# Altium project HSBNE-MAIN.PrjPcb
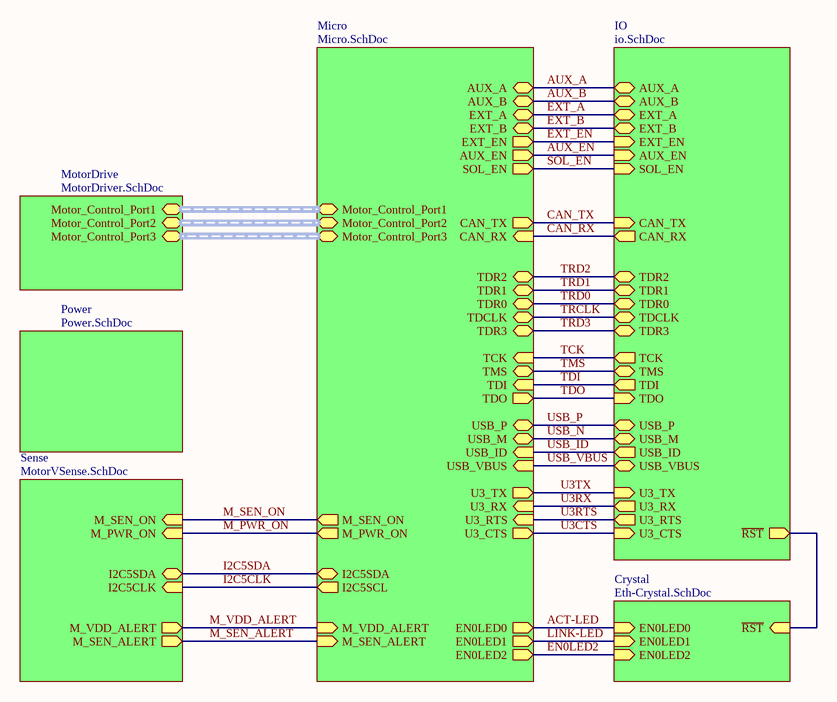
[diagram p0: Main.SchDoc]
3 sheets, 54 parts. Net scope: hierarchical (ports join the sheet entries above them; power ports are global).
Board file: HSBNE-MOTOR.PcbDoc
Sheets:
  Main.SchDoc
    MotorDrive = MotorDriver.SchDoc
    Crystal = Eth-Crystal.SchDoc

## Sheet Main.SchDoc
size A

### Sub-sheets
Crystal = Eth-Crystal.SchDoc: EN0LED0 (in), EN0LED1 (in), EN0LED2 (in), ~{RST} (in)
IO = io.SchDoc (file not in this document): CAN_TX (in), CAN_RX (out), TCK (out), TMS (bidir), TDI (out), TDO (in), U3_RTS (out), U3_CTS (in), U3_TX (in), U3_RX (out), USB_P (bidir), USB_M (bidir), USB_ID (out), ~{RST} (out), TDR1 (bidir), TDR0 (bidir), TDR2 (bidir), TDCLK (bidir), TDR3 (bidir), SOL_EN (in), USB_VBUS, AUX_EN (in), EXT_EN (in), AUX_A (bidir), AUX_B (bidir), EXT_A (bidir), EXT_B (bidir)
Micro = Micro.SchDoc (file not in this document): CAN_TX (out), CAN_RX (in), Motor_Control_Port1 (harness MCP), Motor_Control_Port2 (harness MCP), Motor_Control_Port3 (harness MCP), TCK (in), TMS (bidir), TDI (in), TDO (out), EN0LED0 (out), EN0LED1 (out), EN0LED2 (out), USB_P (bidir), USB_M (bidir), USB_ID (in), USB_VBUS (in), M_PWR_ON (out), M_SEN_ON (out), U3_TX (out), U3_RX (in), U3_RTS (in), U3_CTS (out), M_VDD_ALERT (in), M_SEN_ALERT (in), TDR3 (bidir), TDR0 (bidir), TDCLK (bidir), TDR2 (bidir), TDR1 (bidir), I2C5SDA (bidir), I2C5SCL (out), SOL_EN (out), AUX_A (bidir), AUX_B (bidir), EXT_A (bidir), EXT_B (bidir), EXT_EN (out), AUX_EN (out)
MotorDrive = MotorDriver.SchDoc: Motor_Control_Port1 (harness MCP), Motor_Control_Port2 (harness MCP), Motor_Control_Port3 (harness MCP)
Power = Power.SchDoc (file not in this document): no entries
Sense = MotorVSense.SchDoc (file not in this document): M_SEN_ON (in), M_PWR_ON (in), I2C5CLK (in), M_VDD_ALERT (out), M_SEN_ALERT (out), I2C5SDA (bidir)

### Nets
ACT-LED: sheet Micro/EN0LED0, sheet Crystal/EN0LED0
AUX_A: sheet Micro/AUX_A, sheet IO/AUX_A
AUX_B: sheet Micro/AUX_B, sheet IO/AUX_B
AUX_EN: sheet Micro/AUX_EN, sheet IO/AUX_EN
CAN_RX: sheet Micro/CAN_RX, sheet IO/CAN_RX
CAN_TX: sheet Micro/CAN_TX, sheet IO/CAN_TX
EN0LED2: sheet Micro/EN0LED2, sheet Crystal/EN0LED2
EXT_A: sheet Micro/EXT_A, sheet IO/EXT_A
EXT_B: sheet Micro/EXT_B, sheet IO/EXT_B
EXT_EN: sheet Micro/EXT_EN, sheet IO/EXT_EN
I2C5CLK: sheet Micro/I2C5SCL, sheet Sense/I2C5CLK
I2C5SDA: sheet Micro/I2C5SDA, sheet Sense/I2C5SDA
LINK-LED: sheet Micro/EN0LED1, sheet Crystal/EN0LED1
M_PWR_ON: sheet Micro/M_PWR_ON, sheet Sense/M_PWR_ON
M_SEN_ALERT: sheet Micro/M_SEN_ALERT, sheet Sense/M_SEN_ALERT
M_SEN_ON: sheet Micro/M_SEN_ON, sheet Sense/M_SEN_ON
M_VDD_ALERT: sheet Micro/M_VDD_ALERT, sheet Sense/M_VDD_ALERT
~{RST}: sheet Crystal/~{RST}, sheet IO/~{RST}
SOL_EN: sheet Micro/SOL_EN, sheet IO/SOL_EN
TCK: sheet Micro/TCK, sheet IO/TCK
TDI: sheet Micro/TDI, sheet IO/TDI
TDO: sheet Micro/TDO, sheet IO/TDO
TMS: sheet Micro/TMS, sheet IO/TMS
TRCLK: sheet Micro/TDCLK, sheet IO/TDCLK
TRD0: sheet Micro/TDR0, sheet IO/TDR0
TRD1: sheet Micro/TDR1, sheet IO/TDR1
TRD2: sheet Micro/TDR2, sheet IO/TDR2
TRD3: sheet Micro/TDR3, sheet IO/TDR3
U3CTS: sheet Micro/U3_CTS, sheet IO/U3_CTS
U3RTS: sheet Micro/U3_RTS, sheet IO/U3_RTS
U3RX: sheet Micro/U3_RX, sheet IO/U3_RX
U3TX: sheet Micro/U3_TX, sheet IO/U3_TX
USB_ID: sheet Micro/USB_ID, sheet IO/USB_ID
USB_N: sheet Micro/USB_M, sheet IO/USB_M
USB_P: sheet Micro/USB_P, sheet IO/USB_P
USB_VBUS: sheet Micro/USB_VBUS, sheet IO/USB_VBUS

### Buses and harness runs
harness sheet Micro/Motor_Control_Port1 = sheet MotorDrive/Motor_Control_Port1
harness sheet Micro/Motor_Control_Port2 = sheet MotorDrive/Motor_Control_Port2
harness sheet Micro/Motor_Control_Port3 = sheet MotorDrive/Motor_Control_Port3

## Sheet MotorDriver.SchDoc
size A
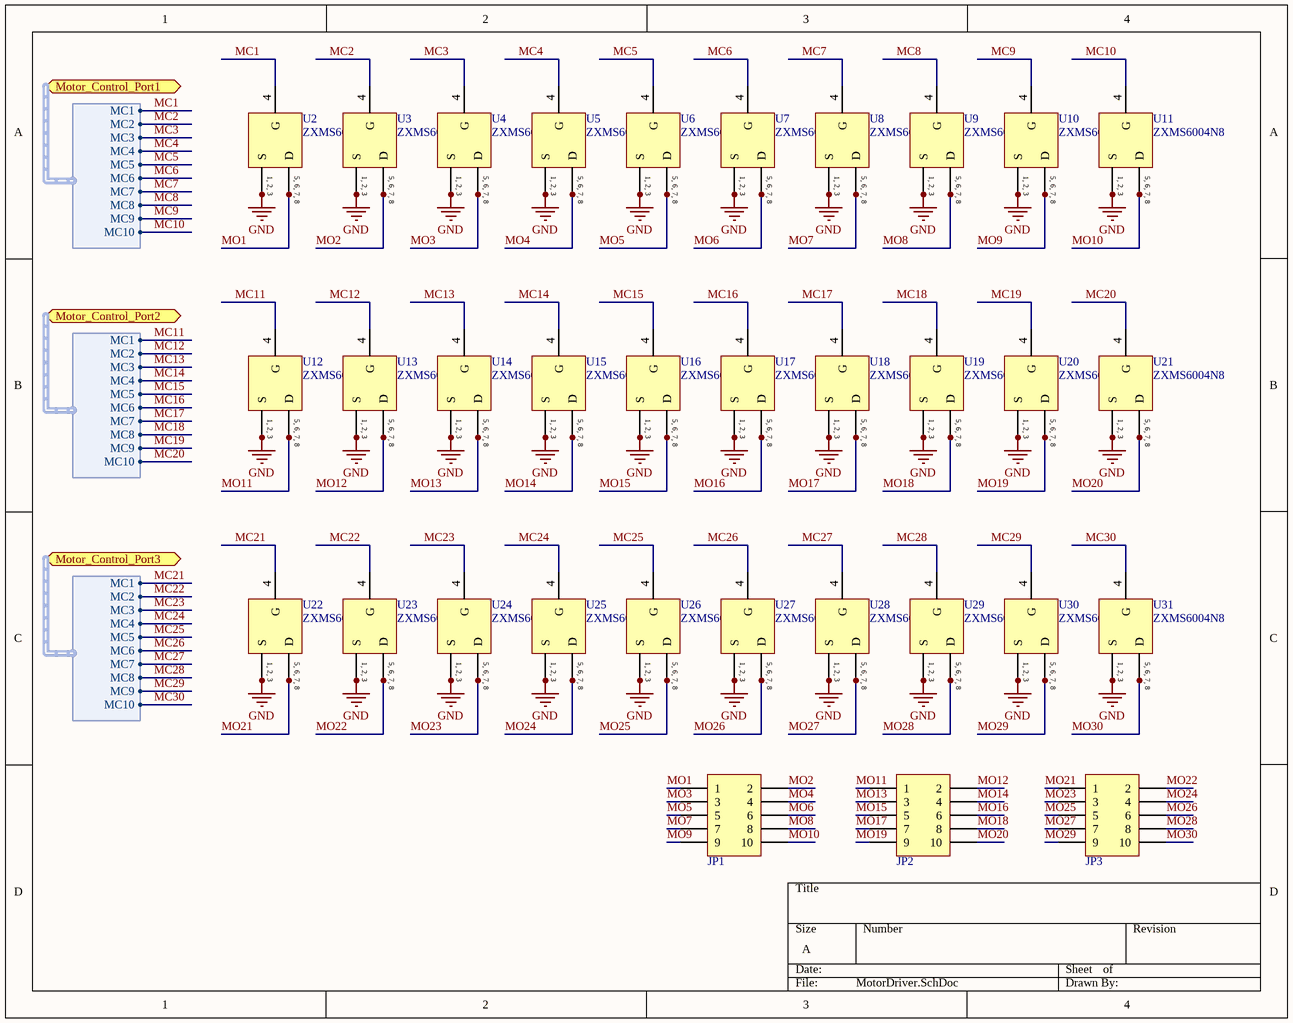
[diagram p1: MotorDriver.SchDoc]

### Parts
JP1  Header 5x2 2.54mm  [2X5]  (value not drawn)
JP2  Header 5x2 2.54mm  [2X5]  (value not drawn)
JP3  Header 5x2 2.54mm  [2X5]  (value not drawn)
U2  ZXMS6004N8  [SO-8]
U3  ZXMS6004N8  [SO-8]
U4  ZXMS6004N8  [SO-8]
U5  ZXMS6004N8  [SO-8]
U6  ZXMS6004N8  [SO-8]
U7  ZXMS6004N8  [SO-8]
U8  ZXMS6004N8  [SO-8]
U9  ZXMS6004N8  [SO-8]
U10  ZXMS6004N8  [SO-8]
U11  ZXMS6004N8  [SO-8]
U12  ZXMS6004N8  [SO-8]
U13  ZXMS6004N8  [SO-8]
U14  ZXMS6004N8  [SO-8]
U15  ZXMS6004N8  [SO-8]
U16  ZXMS6004N8  [SO-8]
U17  ZXMS6004N8  [SO-8]
U18  ZXMS6004N8  [SO-8]
U19  ZXMS6004N8  [SO-8]
U20  ZXMS6004N8  [SO-8]
U21  ZXMS6004N8  [SO-8]
U22  ZXMS6004N8  [SO-8]
U23  ZXMS6004N8  [SO-8]
U24  ZXMS6004N8  [SO-8]
U25  ZXMS6004N8  [SO-8]
U26  ZXMS6004N8  [SO-8]
U27  ZXMS6004N8  [SO-8]
U28  ZXMS6004N8  [SO-8]
U29  ZXMS6004N8  [SO-8]
U30  ZXMS6004N8  [SO-8]
U31  ZXMS6004N8  [SO-8]

### Ports
Motor_Control_Port1 (harness MCP), Motor_Control_Port2 (harness MCP), Motor_Control_Port3 (harness MCP)

### Harnesses
MCP: MC1, MC2, MC3, MC4, MC5, MC6, MC7, MC8, MC9, MC10

### Nets
GND: U2.1(S) U2.2(S) U2.3(S) U3.1(S) U3.2(S) U3.3(S) U4.1(S) U4.2(S) U4.3(S) U5.1(S) U5.2(S) U5.3(S) U6.1(S) U6.2(S) U6.3(S) U7.1(S) U7.2(S) U7.3(S) U8.1(S) U8.2(S) U8.3(S) U9.1(S) U9.2(S) U9.3(S) U10.1(S) U10.2(S) U10.3(S) U11.1(S) U11.2(S) U11.3(S) U12.1(S) U12.2(S) U12.3(S) U13.1(S) U13.2(S) U13.3(S) U14.1(S) U14.2(S) U14.3(S) U15.1(S) U15.2(S) U15.3(S) U16.1(S) U16.2(S) U16.3(S) U17.1(S) U17.2(S) U17.3(S) U18.1(S) U18.2(S) U18.3(S) U19.1(S) U19.2(S) U19.3(S) U20.1(S) U20.2(S) U20.3(S) U21.1(S) U21.2(S) U21.3(S) U22.1(S) U22.2(S) U22.3(S) U23.1(S) U23.2(S) U23.3(S) U24.1(S) U24.2(S) U24.3(S) U25.1(S) U25.2(S) U25.3(S) U26.1(S) U26.2(S) U26.3(S) U27.1(S) U27.2(S) U27.3(S) U28.1(S) U28.2(S) U28.3(S) U29.1(S) U29.2(S) U29.3(S) U30.1(S) U30.2(S) U30.3(S) U31.1(S) U31.2(S) U31.3(S)
MC1: U2.4(G) ; port Motor_Control_Port1.MC1
MC2: U3.4(G) ; port Motor_Control_Port1.MC2
MC3: U4.4(G) ; port Motor_Control_Port1.MC3
MC4: U5.4(G) ; port Motor_Control_Port1.MC4
MC5: U6.4(G) ; port Motor_Control_Port1.MC5
MC6: U7.4(G) ; port Motor_Control_Port1.MC6
MC7: U8.4(G) ; port Motor_Control_Port1.MC7
MC8: U9.4(G) ; port Motor_Control_Port1.MC8
MC9: U10.4(G) ; port Motor_Control_Port1.MC9
MC10: U11.4(G) ; port Motor_Control_Port1.MC10
MC11: U12.4(G) ; port Motor_Control_Port2.MC1
MC12: U13.4(G) ; port Motor_Control_Port2.MC2
MC13: U14.4(G) ; port Motor_Control_Port2.MC3
MC14: U15.4(G) ; port Motor_Control_Port2.MC4
MC15: U16.4(G) ; port Motor_Control_Port2.MC5
MC16: U17.4(G) ; port Motor_Control_Port2.MC6
MC17: U18.4(G) ; port Motor_Control_Port2.MC7
MC18: U19.4(G) ; port Motor_Control_Port2.MC8
MC19: U20.4(G) ; port Motor_Control_Port2.MC9
MC20: U21.4(G) ; port Motor_Control_Port2.MC10
MC21: U22.4(G) ; port Motor_Control_Port3.MC1
MC22: U23.4(G) ; port Motor_Control_Port3.MC2
MC23: U24.4(G) ; port Motor_Control_Port3.MC3
MC24: U25.4(G) ; port Motor_Control_Port3.MC4
MC25: U26.4(G) ; port Motor_Control_Port3.MC5
MC26: U27.4(G) ; port Motor_Control_Port3.MC6
MC27: U28.4(G) ; port Motor_Control_Port3.MC7
MC28: U29.4(G) ; port Motor_Control_Port3.MC8
MC29: U30.4(G) ; port Motor_Control_Port3.MC9
MC30: U31.4(G) ; port Motor_Control_Port3.MC10
MO1: JP1.1 U2.5(D) U2.6(D) U2.7(D) U2.8(D)
MO2: JP1.2 U3.5(D) U3.6(D) U3.7(D) U3.8(D)
MO3: JP1.3 U4.5(D) U4.6(D) U4.7(D) U4.8(D)
MO4: JP1.4 U5.5(D) U5.6(D) U5.7(D) U5.8(D)
MO5: JP1.5 U6.5(D) U6.6(D) U6.7(D) U6.8(D)
MO6: JP1.6 U7.5(D) U7.6(D) U7.7(D) U7.8(D)
MO7: JP1.7 U8.5(D) U8.6(D) U8.7(D) U8.8(D)
MO8: JP1.8 U9.5(D) U9.6(D) U9.7(D) U9.8(D)
MO9: JP1.9 U10.5(D) U10.6(D) U10.7(D) U10.8(D)
MO10: JP1.10 U11.5(D) U11.6(D) U11.7(D) U11.8(D)
MO11: JP2.1 U12.5(D) U12.6(D) U12.7(D) U12.8(D)
MO12: JP2.2 U13.5(D) U13.6(D) U13.7(D) U13.8(D)
MO13: JP2.3 U14.5(D) U14.6(D) U14.7(D) U14.8(D)
MO14: JP2.4 U15.5(D) U15.6(D) U15.7(D) U15.8(D)
MO15: JP2.5 U16.5(D) U16.6(D) U16.7(D) U16.8(D)
MO16: JP2.6 U17.5(D) U17.6(D) U17.7(D) U17.8(D)
MO17: JP2.7 U18.5(D) U18.6(D) U18.7(D) U18.8(D)
MO18: JP2.8 U19.5(D) U19.6(D) U19.7(D) U19.8(D)
MO19: JP2.9 U20.5(D) U20.6(D) U20.7(D) U20.8(D)
MO20: JP2.10 U21.5(D) U21.6(D) U21.7(D) U21.8(D)
MO21: JP3.1 U22.5(D) U22.6(D) U22.7(D) U22.8(D)
MO22: JP3.2 U23.5(D) U23.6(D) U23.7(D) U23.8(D)
MO23: JP3.3 U24.5(D) U24.6(D) U24.7(D) U24.8(D)
MO24: JP3.4 U25.5(D) U25.6(D) U25.7(D) U25.8(D)
MO25: JP3.5 U26.5(D) U26.6(D) U26.7(D) U26.8(D)
MO26: JP3.6 U27.5(D) U27.6(D) U27.7(D) U27.8(D)
MO27: JP3.7 U28.5(D) U28.6(D) U28.7(D) U28.8(D)
MO28: JP3.8 U29.5(D) U29.6(D) U29.7(D) U29.8(D)
MO29: JP3.9 U30.5(D) U30.6(D) U30.7(D) U30.8(D)
MO30: JP3.10 U31.5(D) U31.6(D) U31.7(D) U31.8(D)

### Notes on the sheet
- (in symbol ZXMS6004N8) 1, 2, 3; 5, 6, 7, 8

### Library data of the parts
JP1-JP3 = Header 5x2: Header, 8-Pin; Supplier 1: Farnell; Supplier Part Number 1: 1593440
U2-U31 = ZXMS6004N8: MOSFET N-CH 60V 1.3A S08; Manufacturer: On Semiconductor; PartNumber: NCV8402ASTT1G; Packing: Tape and Reel; Channel Polarity: N Channel; ComponentLink3Description: Package Specification; ComponentLink3URL: http://www.onsemi.com/pub_link/Collateral/318E-04.PDF; ComponentLink1URL: http://www.onsemi.com/; PackageDescription: 4-Pin Small Outline Transistor, Body 6.5 x 3.5 mm, Pitch 2.3 mm; DatasheetVersion: Rev. 8; ComponentLink1Description: Manufacturer URL; Mounting Technology: Surface Mount; PackageVersion: Rev. N, 08/2009; PackageReference: SOT-223-4-318E-04; ComponentLink2URL: http://www.onsemi.com/pub_link/Collateral/NCV8402-D.PDF; ComponentLink2Description: Datasheet; RoHS: Pb-Free

## Sheet Eth-Crystal.SchDoc
size A
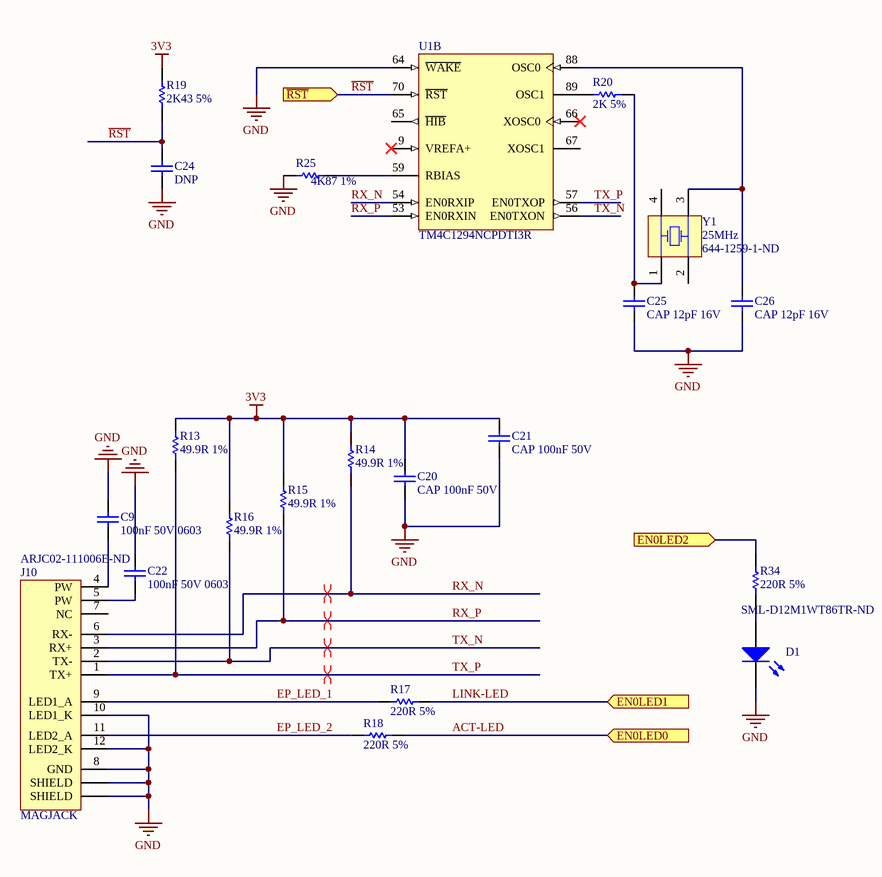
[diagram p2: Eth-Crystal.SchDoc]

### Parts
C9  100nF 50V 0603  [CAPC0603(1608)100_M]
C20  CAP 100nF 50V  [CAPC0603(1608)100_M]
C21  CAP 100nF 50V  [CAPC0603(1608)100_M]
C22  100nF 50V 0603  [CAPC0603(1608)100_M]
C24  DNP  [0603]
C25  CAP 12pF 16V  [CAPC0603(1608)100_L]
C26  CAP 12pF 16V  [CAPC0603(1608)100_L]
D1  Supplier Part Number 2: SML-D12M1WT86TR-ND  [LED-0603]  (hidden comment: LED)
J10  MAGJACK  Supplier Part Number 2: ARJC02-111006E-ND  [magjack]
R13  49.9R 1%  [RESC0603(1608)_M]
R14  49.9R 1%  [RESC0603(1608)_M]
R15  49.9R 1%  [RESC0603(1608)_M]
R16  49.9R 1%  [RESC0603(1608)_M]
R17  220R 5%  [RESC0603(1608)_M]
R18  220R 5%  [RESC0603(1608)_M]
R19  2K43 5%  [RESC0603(1608)_M]
R20  2K 5%  [RESC0603(1608)_N]
R25  4K87 1%  [RESC0603(1608)_M]
R34  220R 5%  [RESC0603(1608)_M]
U1  TM4C1294NCPDTI3R  [TI-PDT128_M]  (part B of 3)
Y1  Supplier Part Number 1: 644-1259-1-ND  [Crystal 3.2x2.5]  (hidden comment: 25MHz)

### Ports
EN0LED0 (in), EN0LED1 (in), EN0LED2 (in), ~{RST} (in)

### Nets
3V3: C20.2 C21.2 R13.2 R14.2 R15.2 R16.2 R19.2
GND: C9.2 C20.1 C21.1 C22.2 C24.1 C25.1 C26.1 D1.2(K) J10.8(GND) J10.10(LED1_K) J10.12(LED2_K) J10.GND1(SHIELD) J10.GND2(SHIELD) R25.1 U1.64(~{WAKE})
ACT-LED: R18.2 ; port EN0LED0
EN0LED2: R34.2 ; port EN0LED2
EP_LED_1: J10.9(LED1_A) R17.1
EP_LED_2: J10.11(LED2_A) R18.1
LINK-LED: R17.2 ; port EN0LED1
~{RST}: C24.2 R19.1 U1.70(~{RST}) ; port ~{RST}
RX_N: J10.6(RX-) R14.1 U1.54(EN0RXIP)
RX_P: J10.3(RX+) R15.1 U1.53(EN0RXIN)
TX_N: J10.2(TX-) R16.1 U1.56(EN0TXON)
TX_P: J10.1(TX+) R13.1 U1.57(EN0TXOP)
NetC9_1: C9.1 J10.4(PW)
NetC22_1: C22.1 J10.5(PW)
NetC25_2: C25.2 R20.2 Y1.1(OSC1)
NetC26_2: C26.2 U1.88(OSC0) Y1.3(OSC2)
NetD1_1: D1.1(A) R34.1
NetR20_1: R20.1 U1.89(OSC1)
NetR25_2: R25.2 U1.59(RBIAS)

Not connected (* = marked no-connect by the designer): J10 7(NC); U1 9(VREFA+)* 65(~{HIB}) 66(XOSC0)* 67(XOSC1); Y1 2(OSC2) 4(OSC1)

### Layout directives
differential pair: RX_N, RX_P, TX_N, TX_P

### Library data of the parts
C9 C22 = CMP-1035-02594-1: CAP 100nF 50V -20% to +80% 0603 (1608 Metric) Thickness 1mm SMD; Case-Metric: 1608; Case-EIA: 0603; Technology: SMT; Rated Voltage: 50 V; Value: 100nF; Max Thickness: 1 mm; Tolerance: -20% to +80%
C20 C21 = CMP-1035-00010-1: CAP 100nF 50V Â±0.1pF 0603 (1608 Metric) Thickness 1mm SMD; Case-Metric: 1608; Case-EIA: 0603; Tolerance: Â±0.1pF; Technology: SMT; Value: 100nF; Max Thickness: 1 mm; Rated Voltage: 50 V
C24 = Cap_100pF: 100nF; Published: 8-Jun-2000; LatestRevisionDate: 29-May-2009; LatestRevisionNote: IPC-7351 Footprint Added.; PackageReference: C1206; Publisher: Altium Limited; PackageDescription: Chip Capacitor; Value: 100nF; Supplier 1: Digi-Key; Supplier Part Number 1: 399-1096-1-ND; Supplier 2: Mouser; Supplier Part Number 2: 80-C0603C104K3R
C25 C26 = CMP-1035-00602-1: CAP 12pF 16V Â±0.25pF 0603 (1608 Metric) Thickness 1mm SMD; Case-EIA: 0603; Case-Metric: 1608; Technology: SMT; Value: 12pF; Max Thickness: 1 mm; Rated Voltage: 16 V; Tolerance: Â±0.25pF
D1 = LED: Typical RED, GREEN, YELLOW, AMBER GaAs LED; Published: 8-Jun-2000; LatestRevisionDate: 17-Jul-2002; LatestRevisionNote: Re-released for DXP Platform.; PackageVersion: Feb-2002; PackageReference: 3.2X1.6X1.1; Publisher: Altium Limited; PackageDescription: SM LED; 2 Flat Leads; Supplier 1: Digi-Key; Supplier Part Number 1: 475-1409-1-ND; Supplier 2: Digikey
R13-R16 = CMP-1012-00042-1: 49.9R 0.1W 1% 0603 (1608 Metric)  SMD; Tolerance: 5 %; Value: 49.90 Ohm; Case-Metric: 1608; Case-EIA: 0603; Technology: SMT; Power: 0.1 W
R17 R18 R34 = CMP-1012-00058-1: 220R 0.1W 5% 0603 (1608 Metric)  SMD; Case-EIA: 0603; Case-Metric: 1608; Value: 220.00 Ohm; Technology: SMT; Power: 0.1 W; Tolerance: 5 %
R19 = CMP-1012-00083-1: 2K43 0.1W 5% 0603 (1608 Metric)  SMD; Value: 2430.00 Ohm; Case-Metric: 1608; Case-EIA: 0603; Tolerance: 5 %; Technology: SMT; Power: 0.1 W
R20 = CMP-1012-00081-1: 2K 0.1W 5% 0603 (1608 Metric)  SMD; Case-Metric: 1608; Value: 2000.00 Ohm; Case-EIA: 0603; Tolerance: 5 %; Technology: SMT; Power: 0.1 W
R25 = CMP-1012-00090-1: 4K87 0.1W 1% 0603 (1608 Metric)  SMD; Tolerance: 5 %; Case-Metric: 1608; Value: 4K87.00 Ohm; Case-EIA: 0603; Technology: SMT; Power: 0.1 W
U1 = CMP-0945-00007-1: Tiva C Series Microcontroller, 1024 KB Flash, 256 KB SRAM, 12 Bit, 20 Channels, -40 to 85 degC, 128-Pin TQFP (PDT), Green (RoHS & no Sb/Br), Tape and Reel; Manufacturer: Texas Instruments; SRAM: 256 KB; ADC Resolution: 12 Bits; ADC Channels: 20; Flash: 1024 KB; Max Speed: 120 MHz; CPU: ARM Cortex-M4; Packing: Tape and Reel; Mounting Technology: Surface Mount; Eco-Plan: Green (RoHS & no Sb/Br); ComponentLink1URL: http://www.ti.com/; ComponentLink3Description: Package Specification; ComponentLink2Description: Datasheet; PartNumber: TM4C1294NCPDTI3R; DatasheetVersion: 15863.2743; ComponentLink1Description: Manufacturer URL; ComponentLink3URL: http://www.ti.com/lit/ml/mpqf013/mpqf013.pdf; Temperature Range: -40 to 85 degC; ComponentLink2URL: http://www.ti.com/lit/ds/symlink/tm4c1294ncpdt.pdf; PackageVersion: 4087726/A; PackageDescription: 128-Pin Thin Quad Flat Package, Body 14 x 14 mm, Pitch 0.4 mm; PartId: 2
Y1 = Crystal_25MHz: Surface Mount Quartz Crystal; Note: PCB layout complies with manufacturer's recommendation.; Published: 17-Jul-2002; DatasheetDocument: 28-Aug-2001; PackageDocument: 28-Aug-2001; PackageReference: 91SMX; Publisher: Altium Limited; ComponentLink1Description: Manufacturer Link; ComponentLink1URL: http://www.cmac.com/mt/; ComponentLink2Description: Datasheet; ComponentLink2URL: http://www.cmac.com/mt/databook/crystals/smd/90_91_smx.pdf; Value: 25MHz; Supplier 1: Digi-Key
J10 = MagJack: Supplier 1: Digikey; Supplier Part Number 1: ARJC02-111008B-ND; Supplier 2: Digikey

## Nets that join several sheets
GND: MotorDriver (90 pins), Eth-Crystal (15 pins)

## Assembly variants
FBOM: not fitted C24 J9 U42